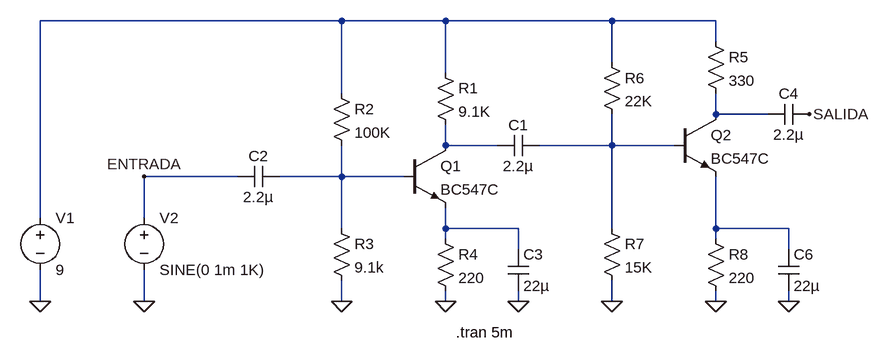
[diagram p0: schematic transistor-amplificador-2-etapas.asc]
transistor-amplificador-2-etapas.asc, the LTspice schematic file:
Version 4
SHEET 1 1528 680
WIRE 192 -160 -272 -160
WIRE 352 -160 192 -160
WIRE 608 -160 352 -160
WIRE 768 -160 608 -160
WIRE 768 -128 768 -160
WIRE 608 -96 608 -160
WIRE 352 -80 352 -160
WIRE 192 -48 192 -160
WIRE 768 -16 768 -48
WIRE 848 -16 768 -16
WIRE 352 32 352 0
WIRE 432 32 352 32
WIRE 608 32 608 -16
WIRE 608 32 496 32
WIRE 704 32 608 32
WIRE 32 80 -112 80
WIRE 192 80 192 32
WIRE 192 80 96 80
WIRE 288 80 192 80
WIRE -272 144 -272 -160
WIRE -112 144 -112 80
WIRE 192 160 192 80
WIRE 352 160 352 128
WIRE 464 160 352 160
WIRE 608 160 608 32
WIRE 768 160 768 80
WIRE 880 160 768 160
WIRE 352 176 352 160
WIRE 768 176 768 160
WIRE 464 192 464 160
WIRE 880 192 880 160
WIRE -272 272 -272 224
WIRE -112 272 -112 224
WIRE 192 272 192 240
WIRE 352 272 352 256
WIRE 464 272 464 256
WIRE 608 272 608 240
WIRE 768 272 768 256
WIRE 880 272 880 256
FLAG -112 272 0
FLAG 352 272 0
FLAG -272 272 0
FLAG -112 80 ENTRADA
FLAG 192 272 0
FLAG 464 272 0
FLAG 768 272 0
FLAG 912 -16 SALIDA
FLAG 608 272 0
FLAG 880 272 0
SYMBOL npn 288 32 R0
SYMATTR InstName Q1
SYMATTR Value BC547C
SYMBOL res 336 -96 R0
SYMATTR InstName R1
SYMATTR Value 9.1K
SYMBOL voltage -272 128 R0
WINDOW 123 0 0 Left 0
WINDOW 39 0 0 Left 0
SYMATTR InstName V1
SYMATTR Value 9
SYMBOL voltage -112 128 R0
WINDOW 123 0 0 Left 0
WINDOW 39 0 0 Left 0
SYMATTR InstName V2
SYMATTR Value SINE(0 1m 1K)
SYMBOL cap 496 16 R90
WINDOW 0 0 32 VBottom 2
WINDOW 3 32 32 VTop 2
SYMATTR InstName C1
SYMATTR Value 2.2µ
SYMBOL cap 96 64 R90
WINDOW 0 0 32 VBottom 2
WINDOW 3 32 32 VTop 2
SYMATTR InstName C2
SYMATTR Value 2.2µ
SYMBOL res 176 -64 R0
SYMATTR InstName R2
SYMATTR Value 100K
SYMBOL res 176 144 R0
SYMATTR InstName R3
SYMATTR Value 9.1k
SYMBOL res 336 160 R0
SYMATTR InstName R4
SYMATTR Value 220
SYMBOL cap 448 192 R0
SYMATTR InstName C3
SYMATTR Value 22µ
SYMBOL npn 704 -16 R0
SYMATTR InstName Q2
SYMATTR Value BC547C
SYMBOL res 752 -144 R0
SYMATTR InstName R5
SYMATTR Value 330
SYMBOL cap 912 -32 R90
WINDOW 0 0 32 VBottom 2
WINDOW 3 32 32 VTop 2
SYMATTR InstName C4
SYMATTR Value 2.2µ
SYMBOL res 592 -112 R0
SYMATTR InstName R6
SYMATTR Value 22K
SYMBOL res 592 144 R0
SYMATTR InstName R7
SYMATTR Value 15K
SYMBOL res 752 160 R0
SYMATTR InstName R8
SYMATTR Value 220
SYMBOL cap 864 192 R0
SYMATTR InstName C6
SYMATTR Value 22µ
TEXT 368 320 Left 2 !.tran 5m

The netlist it stands for:
* transistor-amplificador-2-etapas.asc
Q1 N003 N005 N006 0 BC547C
R1 N001 N003 9.1K
V1 N001 0 9
V2 ENTRADA 0 SINE(0 1m 1K)
C1 N004 N003 2.2µ
C2 N005 ENTRADA 2.2µ
R2 N001 N005 100K
R3 N005 0 9.1k
R4 N006 0 220
C3 N006 0 22µ
Q2 N002 N004 N007 0 BC547C
R5 N001 N002 330
C4 SALIDA N002 2.2µ
R6 N001 N004 22K
R7 N004 0 15K
R8 N007 0 220
C6 N007 0 22µ
.model NPN NPN
.model PNP PNP
.lib standard.bjt
.tran 5m
.backanno
.end